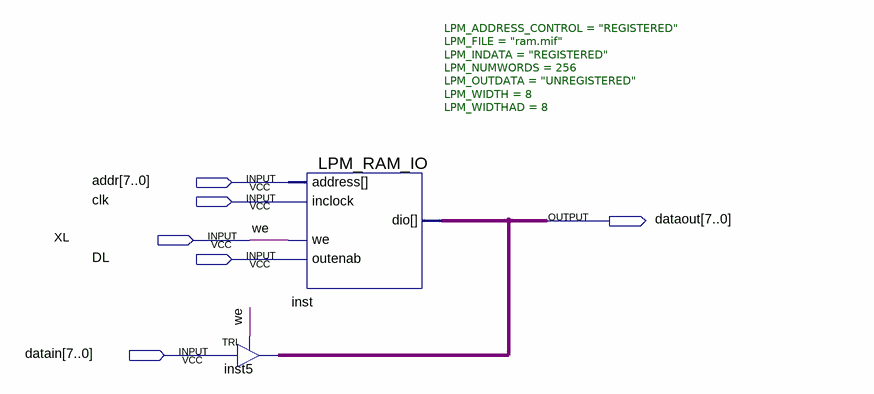
[diagram p0: schematic sheet]
// Quartus schematic ram.bdf as structural Verilog: 2 symbols, 6 pins
module ram (
  input  [7:0] addr,
  input  clk,
  input  XL,
  input  DL,
  input  [7:0] datain,
  output [7:0] dataout
);

  TRI inst5[7:0] (.IN(datain), .OE(XL), .OUT(dataout));
  LPM_RAM_IO #(.LPM_ADDRESS_CONTROL("REGISTERED"), .LPM_FILE("ram.mif"), .LPM_INDATA("REGISTERED"), .LPM_NUMWORDS(256), .LPM_OUTDATA("UNREGISTERED"), .LPM_WIDTH(8), .LPM_WIDTHAD(8)) inst (
    .address(addr), .inclock(clk), .we(XL), .outenab(DL), .dio(dataout));

  // Other names for the same wires on the sheet: we = XL
endmodule
